# Altium schematic sheet RFTranceiver.SchDoc
size A4
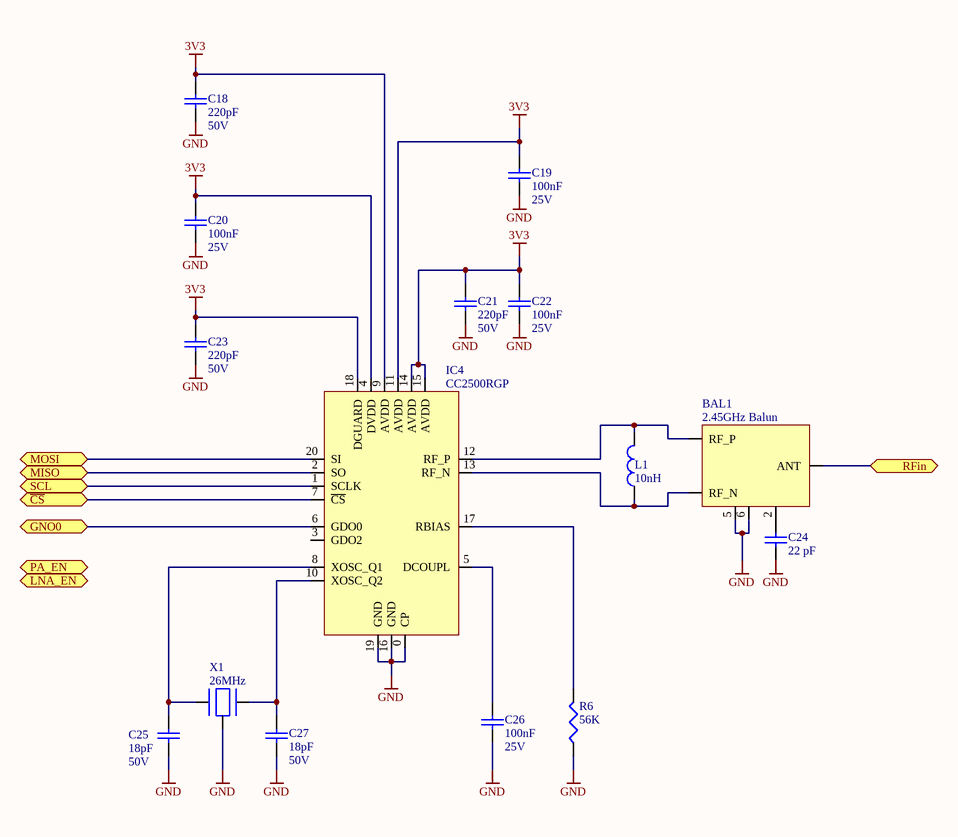
[diagram p0: RFTranceiver.SchDoc]

## Parts
BAL1  2.45GHz Balun  [AgPt]
C18  220pF  Voltage Rating: 50V  [C0402]
C19  100nF  Voltage Rating: 25V  [C0402]
C20  100nF  Voltage Rating: 25V  [C0402]
C21  220pF  Voltage Rating: 50V  [C0402]
C22  100nF  Voltage Rating: 25V  [C0402]
C23  220pF  Voltage Rating: 50V  [C0402]
C24  22 pF  [C0402]
C25  18pF  Voltage Rating: 50V  [C0603]
C26  100nF  Voltage Rating: 25V  [C0402]
C27  18pF  Voltage Rating: 50V  [C0603]
IC4  CC2500RGP  [QFN20]
L1  10nH  [0402]
R6  56K  [0402]
X1  26MHz  [7M]

## Ports
GNO0, LNA_EN, MISO, MOSI, PA_EN, RFin, SCL, ~{CS}

## Nets
3V3: C18.2 C19.2 C20.2 C21.2 C22.2 C23.2 IC4.4(DVDD) IC4.9(AVDD) IC4.11(AVDD) IC4.14(AVDD) IC4.15(AVDD) IC4.18(DGUARD)
GND: BAL1.5(GND) BAL1.6(GND) C18.1 C19.1 C20.1 C21.1 C22.1 C23.1 C24.1 C25.1 C26.1 C27.1 IC4.0(CP) IC4.16(GND) IC4.19(GND) R6.1 X1.0
~{CS}: IC4.7(~{CS}) ; port ~{CS}
GNO0: IC4.6(GDO0) ; port GNO0
MISO: IC4.2(SO) ; port MISO
MOSI: IC4.20(SI) ; port MOSI
RFin: BAL1.1(ANT) ; port RFin
SCL: IC4.1(SCLK) ; port SCL
NetBAL1_2: BAL1.2(GND) C24.2
NetBAL1_3: BAL1.3(RF_N) IC4.13(RF_N) L1.1
NetBAL1_4: BAL1.4(RF_P) IC4.12(RF_P) L1.2
NetC25_2: C25.2 IC4.8(XOSC_Q1) X1.1
NetC26_2: C26.2 IC4.5(DCOUPL)
NetC27_2: C27.2 IC4.10(XOSC_Q2) X1.2
NetIC4_17: IC4.17(RBIAS) R6.2

Not connected (* = marked no-connect by the designer): IC4 3(GDO2)

## Library data of the parts
BAL1 = 2450BM15B0003E: Signal Conditioning 2.45GHz BALUN/FILTER; Brand: JOHANSON TECHNOLOGY; Brand Number: 2450BM15B0003E; Case Style: AgPt; Order Code Supplier: 609-2450BM15B0003E; Price: 1,51; Supplier: Mouser; Temperature Range: -55°C to +155°C
C18 C21 C23 = 220pF/0402/CER/50V: Capacitor, 220pF, 50V, NP0; Capacitance Tolerance: ± 5%; Capacitor Case Style: 0402; Brand Number: GRM1555C1H221JA01D; Brand: MURATA; Dielectric Characteristic: NP0; Capacitance: 220pF; Temperature Range: -55°C to 125°C; Price: 0,02; Order Code Supplier: 8819580; Supplier: Farnell
C19 C20 C22 C26 = 100nF/0402/CER/25V: Capacitor, 100nF, 25V, X7R; Capacitance Tolerance: 10nF; Capacitor Case Style: 0402; Brand Number: GRM155R71E104KE14D; Brand: MULTICOMP; Dielectric Characteristic: X7R; Capacitance: 100nF; Temperature Range: -55 to +125 C; Price: 0,0225; Order Code Supplier: 2456106; Supplier: Farnell
C24 = 22pF/0402/NP0/50V: Capacitor, 22pF, 50V, NP0; Capacitance Tolerance: 0.1 pF; Capacitor Case Style: 0402; Brand Number: 500R07S220GV4T; Brand: JOHANSON TECHNOLOGY; Dielectric Characteristic: NP0; Capacitance: 22 pF; Temperature Range: -55 to +125 C; Price: 0,136; Order Code Supplier: 1885344; Supplier: Farnell; Voltage Rating: 50V
C25 C27 = 18pF/0603/CER/50V: Capacitor, 18pF, 50V, C0G / NP0; Capacitance Tolerance: ± 5%; Capacitor Case Style: 0603; Brand Number: MC0603N180J500CT; Brand: MULTICOMP; Dielectric Characteristic: C0G / NP0; Capacitance: 18pF; Temperature Range: -55°C to +125°C; Price: 0,009; Order Code Supplier: 1759056; Supplier: Farnell
IC4 = CC2500RGP: RF Transceiver Low-Power 2.4 GHz RF Transceiver; Brand: Texas Instruments; Brand Number: CC2500RGP; Case Style: QFN20; Order Code Supplier: 595-CC2500RGP; Price: 3,65; Supplier: Mouser; Temperature Range: -55°C to +155°C
L1 = 10nH-0403: Inductor, 10nH, 250mAdc, 870ohm; Brand: JohansonTechnologies; Brand Number: L-07C10NJV6T; DC Current: 250mA; Q Self resonance: 21GHz; DC Resistance: 870mOhm; Case Style: 0402; Order Code Supplier: 609-L-07C10NJV6T; Price: 0,101; Supplier: Mouser; Temperature Range: *; Inductance: 10nH
R6 = 56k/0402/0063W/50V: Resistor, 56k, 0.1%, 0.0625W, 50V, 100PPM, 0402; Brand: TE Connectivity; Brand Number: CRG0402F56K; Power Rating: 0.063W; Case Style: 0402; Order Code Supplier: 2331545; Price: 0,0075; Resistance: 56K; Supplier: Farnell; Temperature Coefficient: ± 100PPM; Temperature Range: -55°C to +125°C; Voltage Rating: 50V
X1 = 7M-26.000MAAJ-T: CRYSTAL, 26MHz,18PF CL, 3.2X2.5MM SMT; Brand: TXC; Price: 1,04; Supplier: Farnell; Order Code Supplier: 1842069; Brand Number: 7M-26.000MAAJ-T